# Altium schematic sheet I2C_CH2.SchDoc
size A3; ApprovedBy: D. Grossman; CheckedBy: G. Engel; Author: Y. Yakov; CompanyName: LightSense; DrawnBy: Y. Yakov; Engineer: Y.Yakov; Organization: LightSense
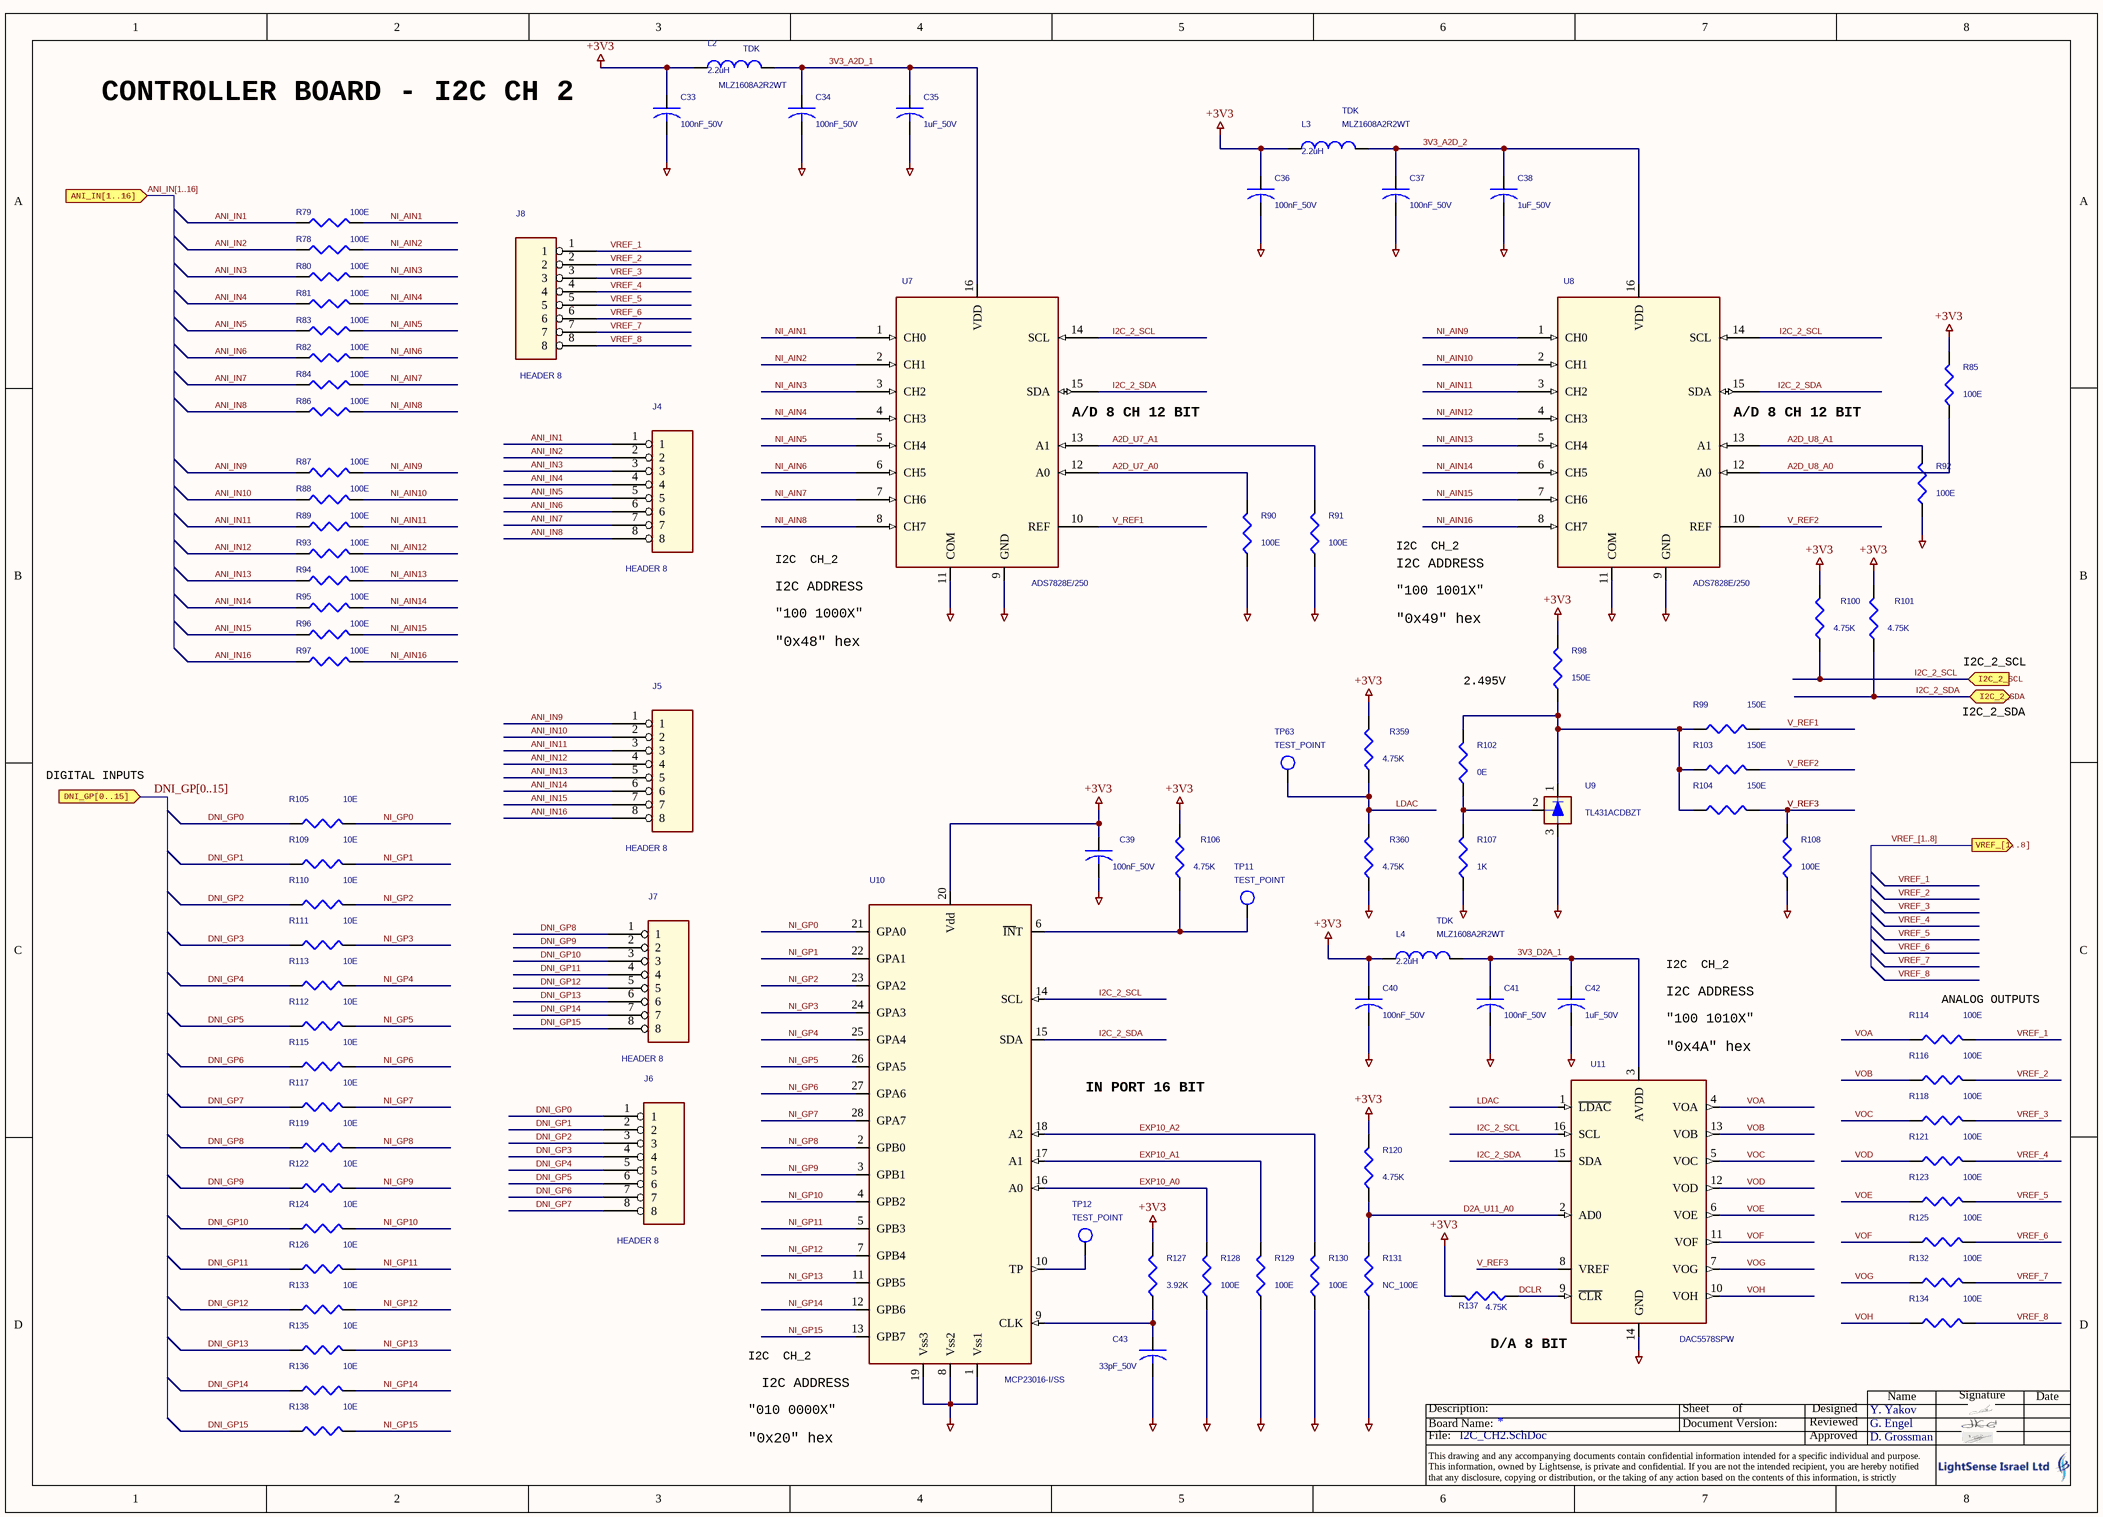
[diagram p0: I2C_CH2.SchDoc]

## Parts
C33  100nF_50V  [0603]
C34  100nF_50V  [0603]
C35  1uF_50V  [0805]
C36  100nF_50V  [0603]
C37  100nF_50V  [0603]
C38  1uF_50V  [0805]
C39  100nF_50V  [0603]
C40  100nF_50V  [0603]
C41  100nF_50V  [0603]
C42  1uF_50V  [0805]
C43  33pF_50V  [0603]
J4  HEADER 8  [TH_8PIN_100mil]
J5  HEADER 8  [TH_8PIN_100mil]
J6  HEADER 8  [TH_8PIN_100mil]
J7  HEADER 8  [TH_8PIN_100mil]
J8  HEADER 8  [TH_8PIN_100mil]
L2  2.2uH  MFG: TDK  MFG_PN: MLZ1608A2R2WT  [0603]
L3  2.2uH  MFG_PN: MLZ1608A2R2WT  MFG: TDK  [0603]
L4  2.2uH  MFG: TDK  MFG_PN: MLZ1608A2R2WT  [0603]
R78  100E  [0603]
R79  100E  [0603]
R80  100E  [0603]
R81  100E  [0603]
R82  100E  [0603]
R83  100E  [0603]
R84  100E  [0603]
R85  100E  [0603]
R86  100E  [0603]
R87  100E  [0603]
R88  100E  [0603]
R89  100E  [0603]
R90  100E  [0603]
R91  100E  [0603]
R92  100E  [0603]
R93  100E  [0603]
R94  100E  [0603]
R95  100E  [0603]
R96  100E  [0603]
R97  100E  [0603]
R98  150E  [0603]
R99  150E  [0603]
R100  4.75K  [0603]
R101  4.75K  [0603]
R102  0E  [0603]
R103  150E  [0603]
R104  150E  [0603]
R105  10E  [0603]
R106  4.75K  [0603]
R107  1K  [0603]
R108  100E  [0603]
R109  10E  [0603]
R110  10E  [0603]
R111  10E  [0603]
R112  10E  [0603]
R113  10E  [0603]
R114  100E  [0603]
R115  10E  [0603]
R116  100E  [0603]
R117  10E  [0603]
R118  100E  [0603]
R119  10E  [0603]
R120  4.75K  [0603]
R121  100E  [0603]
R122  10E  [0603]
R123  100E  [0603]
R124  10E  [0603]
R125  100E  [0603]
R126  10E  [0603]
R127  3.92K  [0603]
R128  100E  [0603]
R129  100E  [0603]
R130  100E  [0603]
R131  NC_100E  [0603]
R132  100E  [0603]
R133  10E  [0603]
R134  100E  [0603]
R135  10E  [0603]
R136  10E  [0603]
R137  4.75K  [0603]
R138  10E  [0603]
R359  4.75K  [0603]
R360  4.75K  [0603]
TP11  TEST_POINT  [TH_1mm]
TP12  TEST_POINT  [TH_1mm]
TP63  TEST_POINT  [TH_1mm]
U7  ADS7828E/250  [TSSOP_16]
U8  ADS7828E/250  [TSSOP_16]
U9  TL431ACDBZT  [SOT_23]
U10  MCP23016-I/SS  [SSOP_28]
U11  DAC5578SPW  [TSSOP_16]

## Ports
ANI_IN[1..16] (in), DNI_GP[0..15] (in), I2C_2_SCL (in), I2C_2_SDA (bidir), VREF_[1..8] (out)

## Nets
+3V3: C33.1 C36.1 C39.1 C40.1 L2.1 L3.1 L4.1 R85.2 R98.2 R100.2 R101.2 R106.2 R120.2 R127.2 R137.2 R359.2 U10.20(Vdd)
GND_CPU: C33.2 C34.2 C35.2 C36.2 C37.2 C38.2 C39.2 C40.2 C41.2 C42.2 C43.2 R90.1 R91.1 R92.1 R107.1 R108.1 R128.1 R129.1 R130.1 R131.1 R360.1 U7.9(GND) U7.11(COM) U8.9(GND) U8.11(COM) U9.3(ANODA) U10.1(Vss1) U10.8(Vss2) U10.19(Vss3) U11.14(GND)
3V3_A2D_1: C34.1 C35.1 L2.2 U7.16(VDD)
3V3_A2D_2: C37.1 C38.1 L3.2 U8.16(VDD)
3V3_D2A_1: C41.1 C42.1 L4.2 U11.3(AVDD)
A2D_U7_A0: R90.2 U7.12(A0)
A2D_U7_A1: R91.2 U7.13(A1)
A2D_U8_A0: R85.1 U8.12(A0)
A2D_U8_A1: R92.2 U8.13(A1)
ANI_IN1: J4.1 R79.2
ANI_IN2: J4.2 R78.2
ANI_IN3: J4.3 R80.2
ANI_IN4: J4.4 R81.2
ANI_IN5: J4.5 R83.2
ANI_IN6: J4.6 R82.2
ANI_IN7: J4.7 R84.2
ANI_IN8: J4.8 R86.2
ANI_IN9: J5.1 R87.2
ANI_IN10: J5.2 R88.2
ANI_IN11: J5.3 R89.2
ANI_IN12: J5.4 R93.2
ANI_IN13: J5.5 R94.2
ANI_IN14: J5.6 R95.2
ANI_IN15: J5.7 R96.2
ANI_IN16: J5.8 R97.2
D2A_U11_A0: R120.1 R131.2 U11.2(AD0)
DCLR: R137.1 U11.9(~{CLR})
DNI_GP0: J6.1 R105.2
DNI_GP1: J6.2 R109.2
DNI_GP2: J6.3 R110.2
DNI_GP3: J6.4 R111.2
DNI_GP4: J6.5 R113.2
DNI_GP5: J6.6 R112.2
DNI_GP6: J6.7 R115.2
DNI_GP7: J6.8 R117.2
DNI_GP8: J7.1 R119.2
DNI_GP9: J7.2 R122.2
DNI_GP10: J7.3 R124.2
DNI_GP11: J7.4 R126.2
DNI_GP12: J7.5 R133.2
DNI_GP13: J7.6 R135.2
DNI_GP14: J7.7 R136.2
DNI_GP15: J7.8 R138.2
EXP10_A0: R128.2 U10.16(A0)
EXP10_A1: R129.2 U10.17(A1)
EXP10_A2: R130.2 U10.18(A2)
I2C_2_SCL: R100.1 U7.14(SCL) U8.14(SCL) U10.14(SCL) U11.16(SCL) ; port I2C_2_SCL
I2C_2_SDA: R101.1 U7.15(SDA) U8.15(SDA) U10.15(SDA) U11.15(SDA) ; port I2C_2_SDA
LDAC: R359.1 R360.2 TP63.1(TP) U11.1(~{LDAC})
NI_AIN1: R79.1 U7.1(CH0)
NI_AIN2: R78.1 U7.2(CH1)
NI_AIN3: R80.1 U7.3(CH2)
NI_AIN4: R81.1 U7.4(CH3)
NI_AIN5: R83.1 U7.5(CH4)
NI_AIN6: R82.1 U7.6(CH5)
NI_AIN7: R84.1 U7.7(CH6)
NI_AIN8: R86.1 U7.8(CH7)
NI_AIN9: R87.1 U8.1(CH0)
NI_AIN10: R88.1 U8.2(CH1)
NI_AIN11: R89.1 U8.3(CH2)
NI_AIN12: R93.1 U8.4(CH3)
NI_AIN13: R94.1 U8.5(CH4)
NI_AIN14: R95.1 U8.6(CH5)
NI_AIN15: R96.1 U8.7(CH6)
NI_AIN16: R97.1 U8.8(CH7)
NI_GP0: R105.1 U10.21(GPA0)
NI_GP1: R109.1 U10.22(GPA1)
NI_GP2: R110.1 U10.23(GPA2)
NI_GP3: R111.1 U10.24(GPA3)
NI_GP4: R113.1 U10.25(GPA4)
NI_GP5: R112.1 U10.26(GPA5)
NI_GP6: R115.1 U10.27(GPA6)
NI_GP7: R117.1 U10.28(GPA7)
NI_GP8: R119.1 U10.2(GPB0)
NI_GP9: R122.1 U10.3(GPB1)
NI_GP10: R124.1 U10.4(GPB2)
NI_GP11: R126.1 U10.5(GPB3)
NI_GP12: R133.1 U10.7(GPB4)
NI_GP13: R135.1 U10.11(GPB5)
NI_GP14: R136.1 U10.12(GPB6)
NI_GP15: R138.1 U10.13(GPB7)
V_REF1: R99.1 U7.10(REF)
V_REF2: R103.1 U8.10(REF)
V_REF3: R104.1 R108.2 U11.8(VREF)
VOA: R114.2 U11.4(VOA)
VOB: R116.2 U11.13(VOB)
VOC: R118.2 U11.5(VOC)
VOD: R121.2 U11.12(VOD)
VOE: R123.2 U11.6(VOE)
VOF: R125.2 U11.11(VOF)
VOG: R132.2 U11.7(VOG)
VOH: R134.2 U11.10(VOH)
VREF_1: J8.1 R114.1
VREF_2: J8.2 R116.1
VREF_3: J8.3 R118.1
VREF_4: J8.4 R121.1
VREF_5: J8.5 R123.1
VREF_6: J8.6 R125.1
VREF_7: J8.7 R132.1
VREF_8: J8.8 R134.1
NetC43_1: C43.1 R127.1 U10.9(CLK)
NetR98_1: R98.1 R99.2 R102.2 R103.2 R104.2 U9.1(CAT)
NetR102_1: R102.1 R107.2 U9.2(Vref)
NetR106_1: R106.1 TP11.1(TP) U10.6(~{IN}T)
NetTP12_1: TP12.1(TP) U10.10(TP)

## Buses and harness runs
bus ANI_IN[1..16] = port ANI_IN[1..16]
bus DNI_GP[0..15] = port DNI_GP[0..15]
bus VREF_[1..8] = port VREF_[1..8]

## Notes on the sheet
- CONTROLLER BOARD - I2C CH 2
- (near U7) A/D 8 CH 12 BIT
- (near U8) A/D 8 CH 12 BIT
- (near U7) I2C ADDRESS
- I2C  CH_2
- I2C ADDRESS
- "100 1001X"
- "0x48" hex
- "100 1000X"
- "0x49" hex
- 2.495V
- I2C_2_SDA
- I2C_2_SCL
- DIGITAL INPUTS
- (near U11) "0x4A" hex
- (near U11) "100 1010X"
- (near R114) ANALOG OUTPUTS
- IN PORT 16 BIT
- (near U10) I2C ADDRESS
- (near U11) D/A 8 BIT
- "0x20" hex
- "010 0000X"
- Name
- Signature
- Date
- File:
- Board Name:
- Description:
- Document Version:
- Sheet
- of
- Approved
- Reviewed
- Designed
- This drawing and any accompanying documents contain confidential information intended for a specific individual and purpose.
  This information, owned by Lightsense, is private and confidential. If you are not the intended recipient, you are hereby notified that any disclosure, copying or distribution, or the taking of any action based on the contents of this information, is strictly prohibited.

## Library data of the parts
C33 C34 C40 = C: CAP_SMT_0603_50V_X7R_10%; MFG_PN: C0603C104K5RAC; MFG: KEMET
C35 C38 C42 = CAP: a; Mnfctr_Part_Number: TCJT106M016R0150; MFG: Murata; MFG_PN: GRM21BR60J106K
C36 C37 C41 = C: CAP_SMT_0603_50V_X7R_10%; MFG: KEMET; MFG_PN: C0603C104K5RAC
C39 = C: CAP_SMT_0603_50V_X7R_10%; MFG: KEMET; Lumenis_P/N: EC1691600; MFG_PN: C0603C104K5RAC
C43 = C: CAP_SMT_0603_50V_X7R_10%; MFG: KEMET; MFG_PN: C0603C330K5RAC
L2-L4 = INDUCTOR
R78 R79 R83 R91-R95 R114 R116 R118 R121 R123 R125 R128 R130-R132 R134 = R_Dup1: MFG: YAGEO; MFG_PN: RC0603FR-07100RL
R80-R82 R84-R90 R96 R97 R108 R129 = R_Dup1: MFG_PN: RC0603FR-07100RL; MFG: YAGEO
R98 R103 R104 = R_Dup1: MFG_PN: RC0603FR-07150RL; MFG: YAGEO
R99 = R_Dup1: MFG: YAGEO; MFG_PN: RC0603FR-07150RL
R100 R101 R106 R120 R360 = R_Dup1: MFG: YAGEO; MFG_PN: RC0603FR-074K75L
R102 = R_Dup1: MFG: YAGEO; MFG_PN: RC0603FR-070R00L
R105 R109-R113 R115 R117 R119 R122 R124 R126 R133 R135 R136 R138 = R_Dup1: MFG_PN: RC0603FR-0710R0L; MFG: YAGEO
R107 = R_Dup1: MFG_PN: RC0603FR-071K00L; MFG: YAGEO
R127 = R_Dup1: MFG_PN: RC0603FR-073K92L; MFG: YAGEO
R137 R359 = R_Dup1: MFG_PN: RC0603FR-074K75L; MFG: YAGEO
TP11 TP12 TP63 = T POINT R_Dup1
U7 U8 = ADS7828E: MFG: TI; MFG_PN: ADS7828E/250
U9 = TL431ACDBZT: Part_Number: <Part_Number>; MFG: TI; MFG_PN: TL431ACDBZT
U10 = MCP23016-I/SS: MFG: MICROCHIP; MFG_PN: MCP23016-I/SS
U11 = DAC5578SPW: MFG: TI; MFG_PN: DAC5578SPW